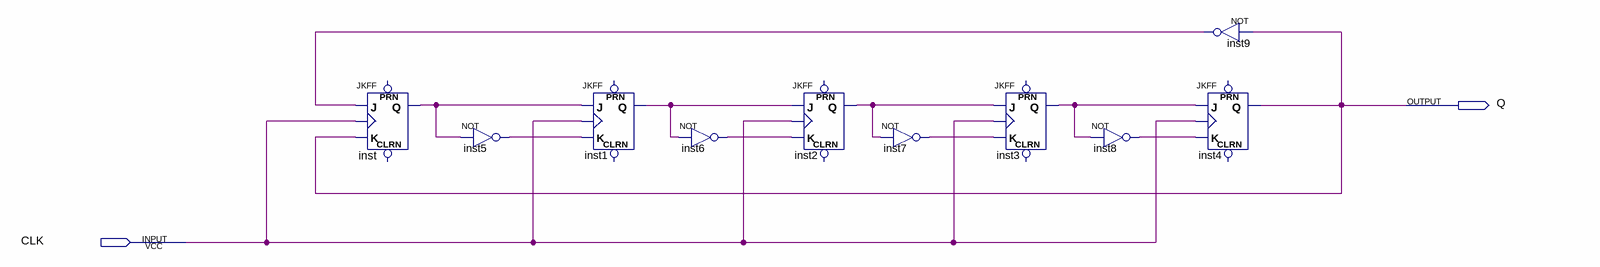
[diagram p0: schematic sheet]
// Quartus schematic TenBunshu.bdf as structural Verilog: 10 symbols, 2 pins
module TenBunshu (
  input  CLK,
  output Q
);

  wire inst1_q, inst2_q, inst3_q, inst5_out, inst6_out, inst7_out, inst8_out, inst9_out, inst_q;

  JKFF inst (.K(Q), .J(inst9_out), .CLK(CLK), .Q(inst_q));  // open: PRN, CLRN
  not inst5 (inst5_out, inst_q);
  JKFF inst1 (.K(inst5_out), .J(inst_q), .CLK(CLK), .Q(inst1_q));  // open: PRN, CLRN
  not inst6 (inst6_out, inst1_q);
  JKFF inst2 (.K(inst6_out), .J(inst1_q), .CLK(CLK), .Q(inst2_q));  // open: PRN, CLRN
  not inst7 (inst7_out, inst2_q);
  JKFF inst3 (.K(inst7_out), .J(inst2_q), .CLK(CLK), .Q(inst3_q));  // open: PRN, CLRN
  not inst8 (inst8_out, inst3_q);
  not inst9 (inst9_out, Q);
  JKFF inst4 (.K(inst8_out), .J(inst3_q), .CLK(CLK), .Q(Q));  // open: PRN, CLRN
endmodule
